# Altium schematic sheet FPGA_Top.SchDoc
size A4
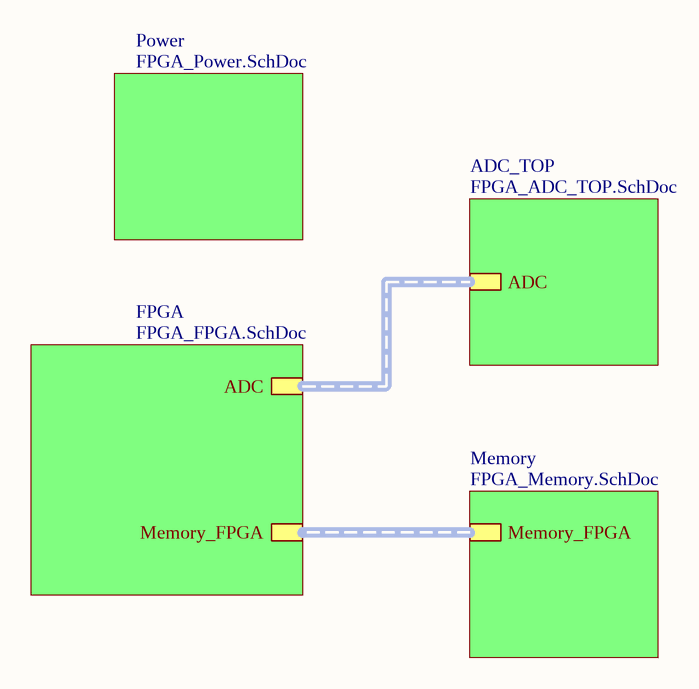
[diagram p0: FPGA_Top.SchDoc]

## Sub-sheets
ADC_TOP = FPGA_ADC_TOP.SchDoc: ADC (harness ADC_BUS)
FPGA = FPGA_FPGA.SchDoc: Memory_FPGA (harness Memory), ADC (harness Memory)
Memory = FPGA_Memory.SchDoc: Memory_FPGA (harness Memory)
Power = FPGA_Power.SchDoc: no entries

## Buses and harness runs
harness sheet ADC_TOP/ADC = sheet FPGA/ADC
harness sheet FPGA/Memory_FPGA = sheet Memory/Memory_FPGA